# Altium schematic sheet 1.27-6P-TPHS1_1.27-6P-TPHS.schdoc
size 127 x 99 mm
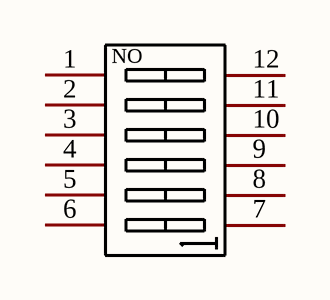
[diagram p0: 1.27-6P-TPHS1_1.27-6P-TPHS.schdoc]

## Parts
SW?  1.27-6P-TPHS  (value not drawn)

## Nets

Not connected (* = marked no-connect by the designer): SW? 1(A1) 2(A2) 3(A3) 4(A4) 5(A5) 6(A6) 7(B6) 8(B5) 9(B4) 10(B3) 11(B2) 12(B1)

## Notes on the sheet
- (in symbol 1.27-6P-TPHS) NO

## Library data of the parts
SW? = 1.27-6P-TPHS: Manufacturer: SHOU HAN(首韩); Add into BOM: yes; Current Rating: 25mA; Voltage Rating: 24V; Circuit: 单刀单掷; Number of Positions: 6; Pin Style: 鸥翼型; Operating Life: 3000; Name: 1.27-6P-TPHS; Symbol: 1.27-6P-TPHS; Device: 1.27-6P-TPHS; LCSC Part Name: 1.27-6P-TPHS; Supplier Part: C2859408; Manufacturer Part: 1.27-6P-TPHS; Supplier Footprint: SMD; JLCPCB Part Class: Extended Part; Datasheet: https://atta.szlcsc.com/upload/public/pdf/source/20210803/C2859408_990485A2D9C3A96571811E2405DF6A71.pdf; Supplier: LCSC; Convert to PCB: yes; Type: 平拨，凹槽式; Lead Pitch: 1.27mm; Operating Temperature: -20℃~+70℃; Color: 黑色